# EAGLE schematic XMICRO-SERIAL V1.0 (EAGLE 6.3)
PROJECT_NAME: XMICRO-SERIAL; PROJECT_REVISION: 1.0

## Sheet 1 of 6: UARTs
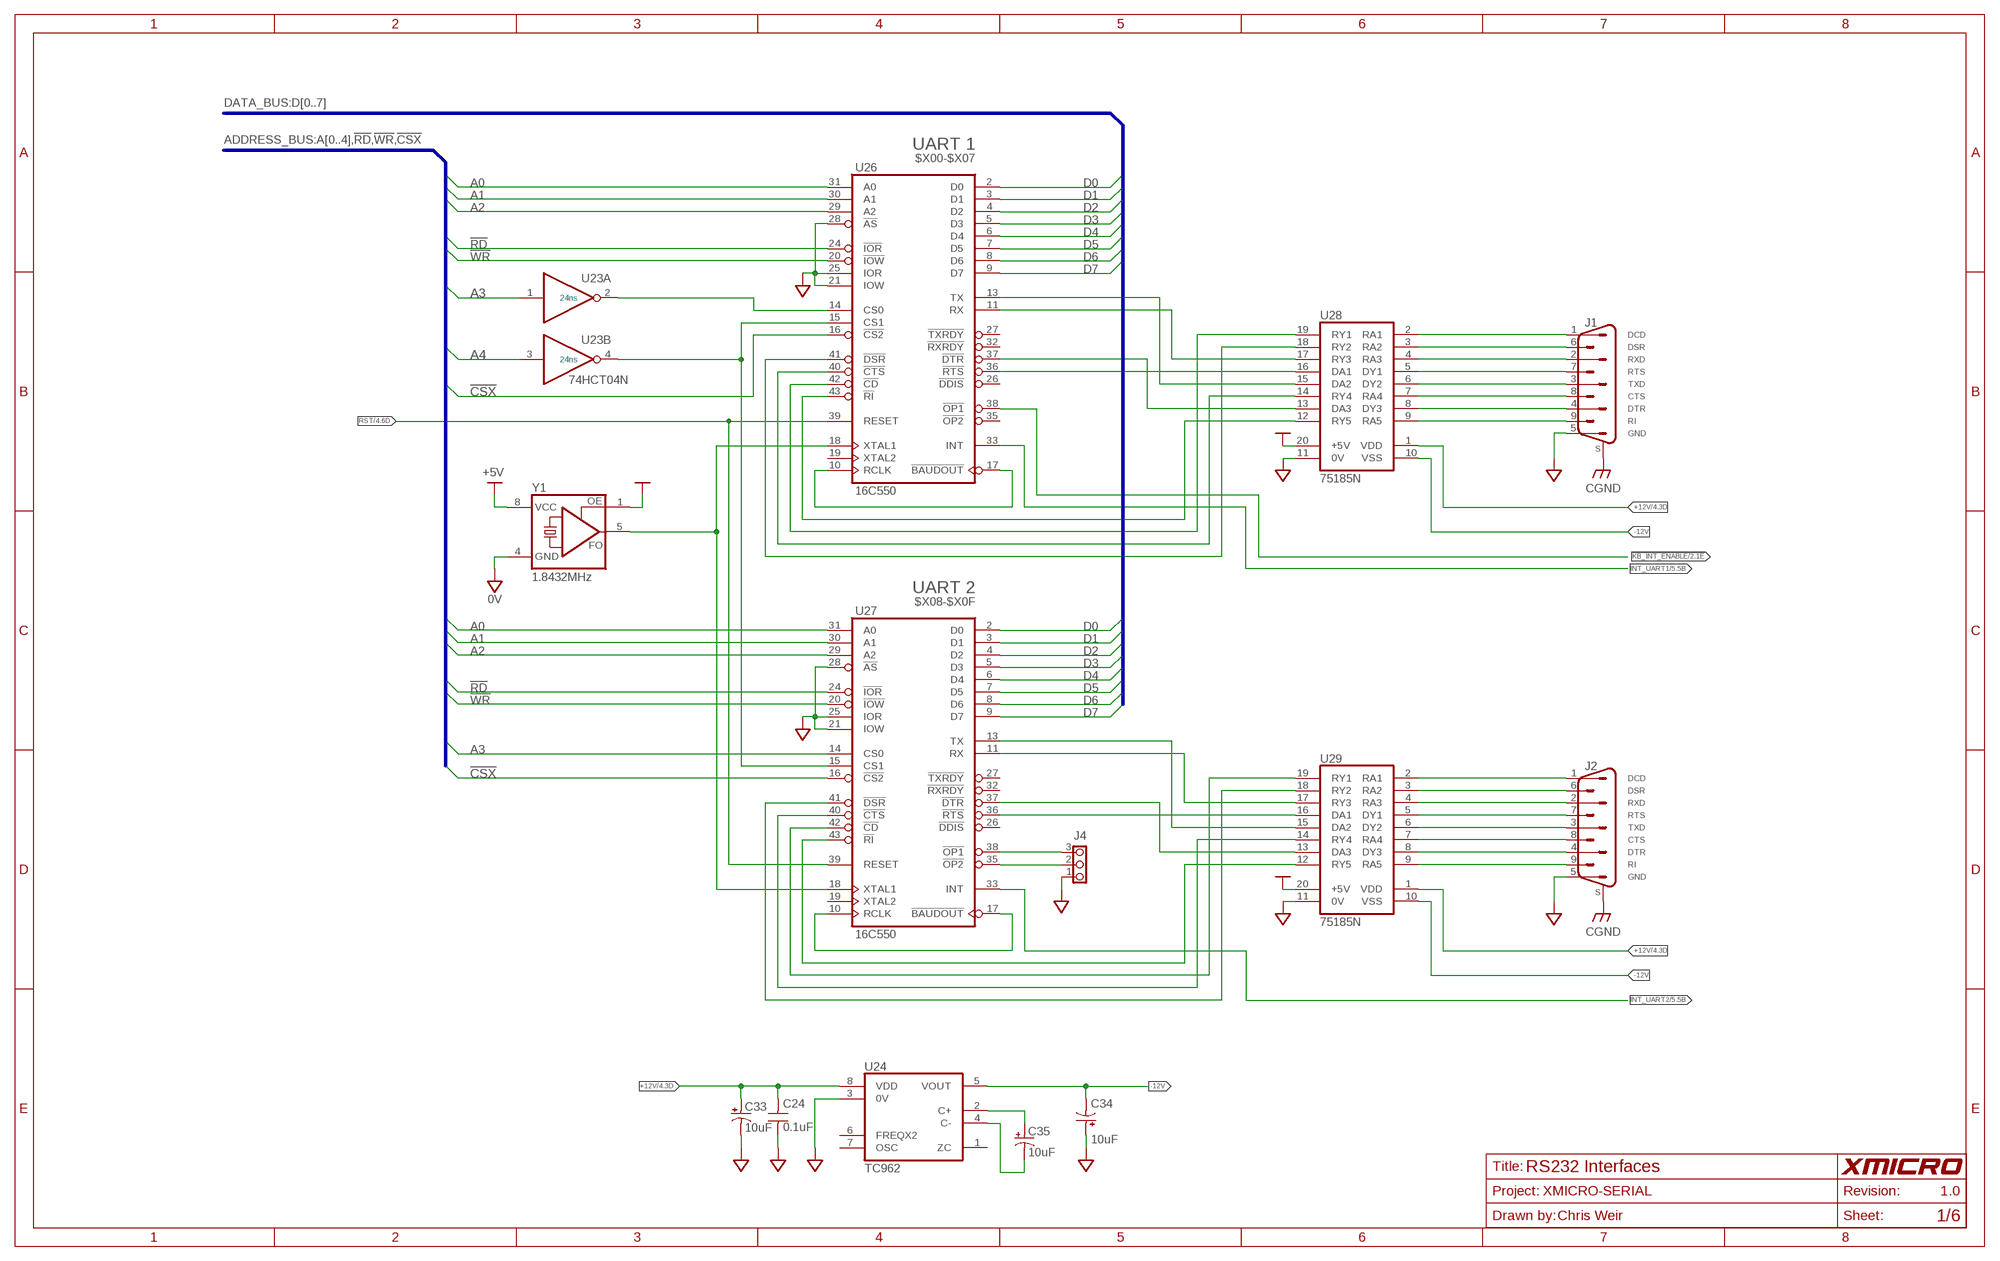
[diagram p0: schematic, sheet 1]
FRAME1 (11X17): DRAWN_BY: Chris Weir; SHEET_TITLE: RS232 Interfaces

### Parts
C24  0.1uF  C-US025-024X044  [C025-024X044]
C33  10uF  CPOL-USE2.5-5  [E2,5-5]
C34  10uF  CPOL-USE2.5-5  [E2,5-5]
C35  10uF  CPOL-USE2.5-5  [E2,5-5]
J1  DSUB-9M-PH  [DSUB-9M-H]
J2  DSUB-9M-PH  [DSUB-9M-H]
J4  1X3  [1X3]
U23  74HCT04N  [DIL14]
U24  TC962  [DIL8]
U26  16C550  16C550S44  [S44]
U27  16C550  16C550S44  [S44]
U28  75185N  75C185N  [DIL20]
U29  75185N  75C185N  [DIL20]
Y1  1.8432MHz  OSC-OE  [DIL08S]

### Nets
0V [0V]: C24.2 C33.- C34.+ J1.5 J2.5 J4.1 U24.3(0V) U26.21(IOW) U26.25(IOR) U26.28(!AS) U27.21(IOW) U27.25(IOR) U27.28(!AS) U28.11(0V) U29.11(0V) Y1.4(0V) ; also sheet 2,3,4,5,6
!CSX: U26.16(!CS2) U27.16(!CS2) ; also sheet 4,5
!KB_INT_ENABLE: U26.38(!OP1) ; also sheet 2
!RD: U26.24(!IOR) U27.24(!IOR) ; also sheet 4,5
!WR: U26.20(!IOW) U27.20(!IOW) ; also sheet 4,5
+5V [SUPPLY]: U28.20(+5V) U29.20(+5V) Y1.1(OE) Y1.8(+5V) ; also sheet 2,3,4,5,6
+12V [SUPPLY]: C24.1 C33.+ U24.8(VDD) U28.1(VDD) U29.1(VDD) ; also sheet 4
-12V [SUPPLY]: C34.- U24.5(VOUT) U28.10(VSS) U29.10(VSS)
A0: U26.31(A0) U27.31(A0) ; also sheet 4,5
A1: U26.30(A1) U27.30(A1) ; also sheet 4,5
A2: U26.29(A2) U27.29(A2) ; also sheet 4,5
A3: U23.1(A:I) U27.14(CS0) ; also sheet 4
A4: U23.3(B:I) ; also sheet 4,5
CGND [CHASSIS]: J1.S1(S) J1.S2(S) J2.S1(S) J2.S2(S) ; also sheet 2,6
D0: U26.2(D0) U27.2(D0) ; also sheet 2,3,4,5
D1: U26.3(D1) U27.3(D1) ; also sheet 2,3,4,5
D2: U26.4(D2) U27.4(D2) ; also sheet 2,3,4,5
D3: U26.5(D3) U27.5(D3) ; also sheet 2,3,4,5
D4: U26.6(D4) U27.6(D4) ; also sheet 2,3,4,5
D5: U26.7(D5) U27.7(D5) ; also sheet 2,3,4,5
D6: U26.8(D6) U27.8(D6) ; also sheet 2,3,4,5
D7: U26.9(D7) U27.9(D7) ; also sheet 2,3,4,5
INT_UART1: U26.33(INT) ; also sheet 5,6
INT_UART2: U27.33(INT) ; also sheet 5,6
N$1: J1.1 U28.2(RA1)
N$2: J1.2 U28.4(RA3)
N$3: J1.3 U28.6(DY2)
N$4: J1.4 U28.8(DY3)
N$5: J1.6 U28.3(RA2)
N$6: J1.7 U28.5(DY1)
N$7: J1.8 U28.7(RA4)
N$8: J1.9 U28.9(RA5)
N$9: J2.1 U29.2(RA1)
N$10: U26.43(!RI) U28.12(RY5)
N$11: U26.37(!DTR) U28.13(DA3)
N$12: U26.40(!CTS) U28.14(RY4)
N$13: U26.13(TX) U28.15(DA2)
N$14: U26.36(!RTS) U28.16(DA1)
N$15: U26.11(RX) U28.17(RY3)
N$16: U26.41(!DSR) U28.18(RY2)
N$17: U26.42(!CD) U28.19(RY1)
N$18: U26.10(RCLK) U26.17(!BAUDOUT)
N$27: C35.- U24.4(C-)
N$28: J2.2 U29.4(RA3)
N$29: J2.3 U29.6(DY2)
N$30: J2.4 U29.8(DY3)
N$31: J2.6 U29.3(RA2)
N$32: J2.7 U29.5(DY1)
N$41: J2.8 U29.7(RA4)
N$42: J2.9 U29.9(RA5)
N$43: C35.+ U24.2(C+)
N$46: U23.2(A:O) U26.14(CS0)
N$47: U27.43(!RI) U29.12(RY5)
N$48: U27.37(!DTR) U29.13(DA3)
N$49: U27.40(!CTS) U29.14(RY4)
N$51: J4.3 U27.38(!OP1)
N$52: J4.2 U27.35(!OP2)
N$60: U27.13(TX) U29.15(DA2)
N$61: U27.36(!RTS) U29.16(DA1)
N$62: U27.11(RX) U29.17(RY3)
N$63: U27.41(!DSR) U29.18(RY2)
N$64: U27.42(!CD) U29.19(RY1)
N$65: U27.10(RCLK) U27.17(!BAUDOUT)
N$114: U23.4(B:O) U26.15(CS1) U27.15(CS1)
N$116: U26.18(XTAL1) U27.18(XTAL1) Y1.5(FO)
RST: U26.39(RESET) U27.39(RESET) ; also sheet 4
Unconnected: U24.1(ZC) U24.6(FREQX2) U24.7(OSC) U26.19(XTAL2) U26.26(!DDIS) U26.27(!TXRDY) U26.32(!RXRDY) U26.35(!OP2) U27.19(XTAL2) U27.26(!DDIS) U27.27(!TXRDY) U27.32(!RXRDY)

### Buses
DATA_BUS:D[0..7]
ADDRESS_BUS:A[0..4],!RD,!WR,!CSX

### Notes on the sheet
- UART 1
- $X00-$X07
- DCD
- DSR
- RXD
- RTS
- TXD
- CTS
- DTR
- RI
- GND
- UART 2
- $X08-$X0F
- DCD
- DSR
- RXD
- RTS
- TXD
- CTS
- DTR
- RI
- GND

## Sheet 2 of 6: PS/2 Receive
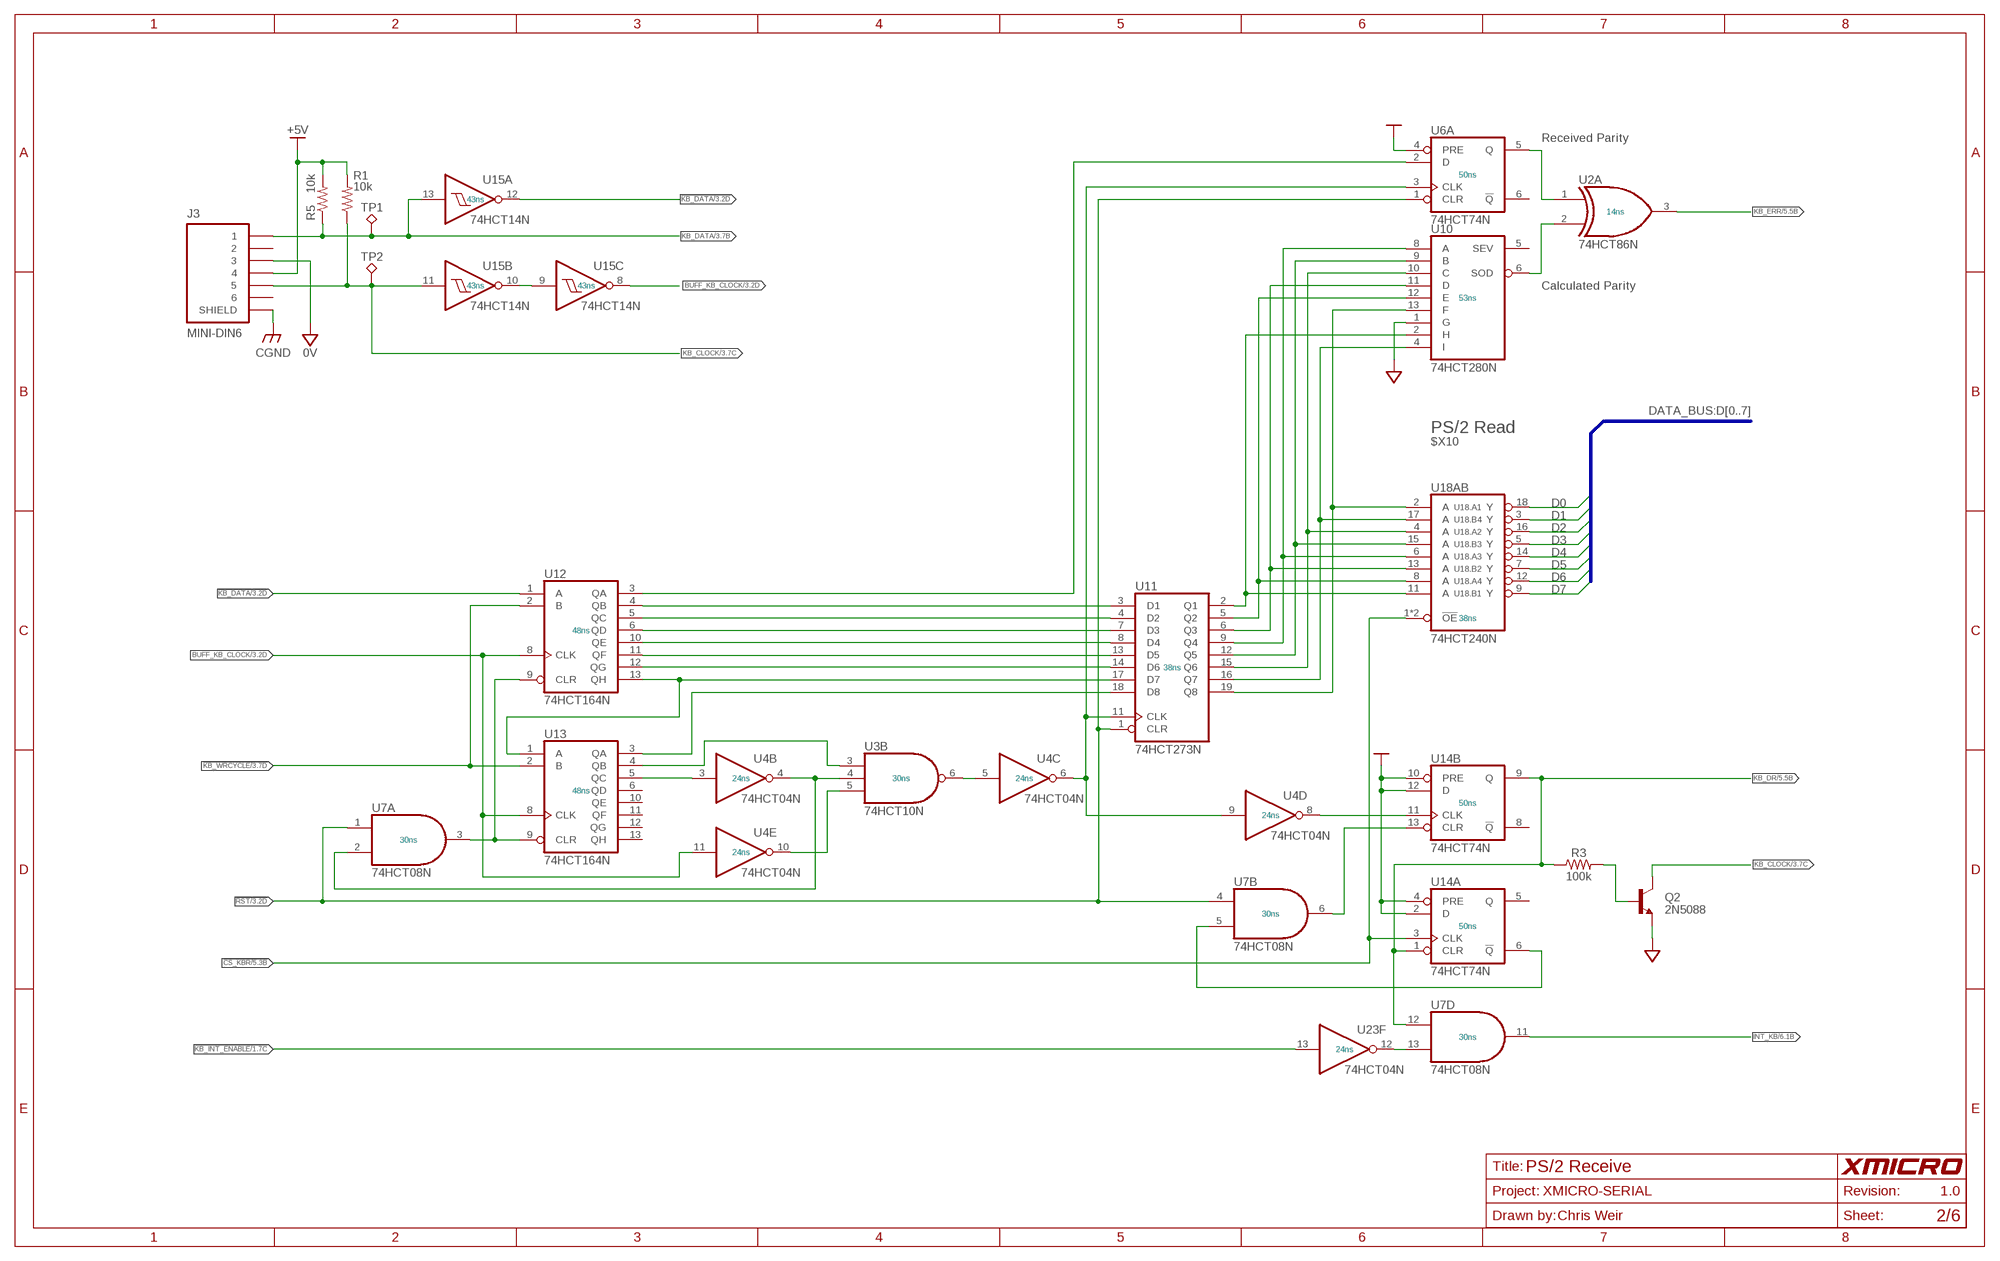
[diagram p1: schematic, sheet 2]
FRAME2 (11X17): DRAWN_BY: Chris Weir; SHEET_TITLE: PS/2 Receive

### Parts
J3  MINI-DIN6  [MINI-DIN6]
Q2  2N5088  [TO92]
R1  10k  R-US_0207/10  [0207/10]
R3  100k  R-US_0207/10  [0207/10]
R5  10k  R-US_0207/10  [0207/10]
TP1  TP-040  [TP-040]
TP2  TP-040  [TP-040]
U2  74HCT86N  [DIL14]
U3  74HCT10N  [DIL14]
U4  74HCT04N  [DIL14]
U6  74HCT74N  [DIL14]
U7  74HCT08N  [DIL14]
U10  74HCT280N  [DIL14]
U11  74HCT273N  [DIL20]
U12  74HCT164N  [DIL14]
U13  74HCT164N  [DIL14]
U14  74HCT74N  [DIL14]
U15  74HCT14N  [DIL14]
U18  74HCT240N  74HCT240-1SN  [DIL20]

### Nets
0V [0V]: J3.3 Q2.1(E) U10.1(G) ; also sheet 1,3,4,5,6
!CS_KBR: U14.3(A:CLK) U18.1(AB:!OE) U18.19(AB:!OE) ; also sheet 5
!KB_DATA: U12.1(A) U15.12(A:O) ; also sheet 3
!KB_INT_ENABLE: U23.13(F:I) ; also sheet 1
!KB_WRCYCLE: U12.2(B) U13.2(B) ; also sheet 3
!RST: U6.1(A:CLR) U7.1(A:I0) U7.4(B:I0) U11.1(CLR) ; also sheet 3,4
+5V [SUPPLY]: J3.4 R1.2 R5.2 U6.4(A:PRE) U14.2(A:D) U14.4(A:PRE) U14.10(B:PRE) U14.12(B:D) ; also sheet 1,3,4,5,6
BUFF_KB_CLOCK: U4.11(E:I) U12.8(CLK) U13.8(CLK) U15.8(C:O) ; also sheet 3
CGND [CHASSIS]: J3.G$1(SHIELD) J3.G$2(SHIELD) J3.G$3(SHIELD) ; also sheet 1,6
D0: U18.18(.A1:Y) ; also sheet 1,3,4,5
D1: U18.3(.B4:Y) ; also sheet 1,3,4,5
D2: U18.16(.A2:Y) ; also sheet 1,3,4,5
D3: U18.5(.B3:Y) ; also sheet 1,3,4,5
D4: U18.14(.A3:Y) ; also sheet 1,3,4,5
D5: U18.7(.B2:Y) ; also sheet 1,3,4,5
D6: U18.12(.A4:Y) ; also sheet 1,3,4,5
D7: U18.9(.B1:Y) ; also sheet 1,3,4,5
INT_KB: U7.11(D:O) ; also sheet 6
KB_CLOCK: J3.5 Q2.3(C) R1.1 TP2.1 U15.11(B:I) ; also sheet 3
KB_DATA: J3.1 R5.1 TP1.1 U15.13(A:I) ; also sheet 3
KB_DR: R3.1 U7.12(D:I0) U14.1(A:CLR) U14.9(B:Q) ; also sheet 5
KB_ERR: U2.3(A:O) ; also sheet 5
N$19: U3.6(B:O) U4.5(C:I)
N$20: U4.8(D:O) U14.11(B:CLK)
N$26: U15.9(C:I) U15.10(B:O)
N$50: U7.13(D:I1) U23.12(F:O)
N$66: U11.17(D7) U12.13(QH) U13.1(A)
N$67: U11.18(D8) U13.3(QA)
N$69: U4.3(B:I) U13.5(QC)
N$70: U3.4(B:I1) U4.4(B:O) U7.2(A:I1)
N$71: U4.6(C:O) U4.9(D:I) U6.3(A:CLK) U11.11(CLK)
N$72: U3.3(B:I0) U13.4(QB)
N$73: U11.14(D6) U12.12(QG)
N$74: U11.13(D5) U12.11(QF)
N$76: U11.7(D3) U12.6(QD)
N$77: U11.4(D2) U12.5(QC)
N$78: U11.3(D1) U12.4(QB)
N$79: U6.2(A:D) U12.3(QA)
N$81: U7.3(A:O) U12.9(CLR) U13.9(CLR)
N$82: U7.6(B:O) U14.13(B:CLR)
N$84: U2.1(A:I0) U6.5(A:Q)
N$86: U10.13(F) U11.19(Q8) U18.2(.A1:A)
N$90: U10.4(I) U11.16(Q7) U18.17(.B4:A)
N$91: U10.10(C) U11.15(Q6) U18.4(.A2:A)
N$92: U10.9(B) U11.12(Q5) U18.15(.B3:A)
N$94: U10.11(D) U11.6(Q3) U18.13(.B2:A)
N$95: U10.12(E) U11.5(Q2) U18.8(.A4:A)
N$96: U10.2(H) U11.2(Q1) U18.11(.B1:A)
N$97: U10.8(A) U11.9(Q4) U18.6(.A3:A)
N$101: U2.2(A:I1) U10.6(SOD)
N$102: U3.5(B:I2) U4.10(E:O)
N$105: Q2.2(B) R3.2
N$108: U7.5(B:I1) U14.6(A:!Q)
UC4: U11.8(D4) U12.10(QE)
Unconnected: J3.2 J3.6 U6.6(A:!Q) U10.5(SEV) U13.6(QD) U13.10(QE) U13.11(QF) U13.12(QG) U13.13(QH) U14.5(A:Q) U14.8(B:!Q)

### Buses
DATA_BUS:D[0..7]

### Notes on the sheet
- Received Parity
- Calculated Parity
- PS/2 Read
- $X10

## Sheet 3 of 6: PS/2 Transmit
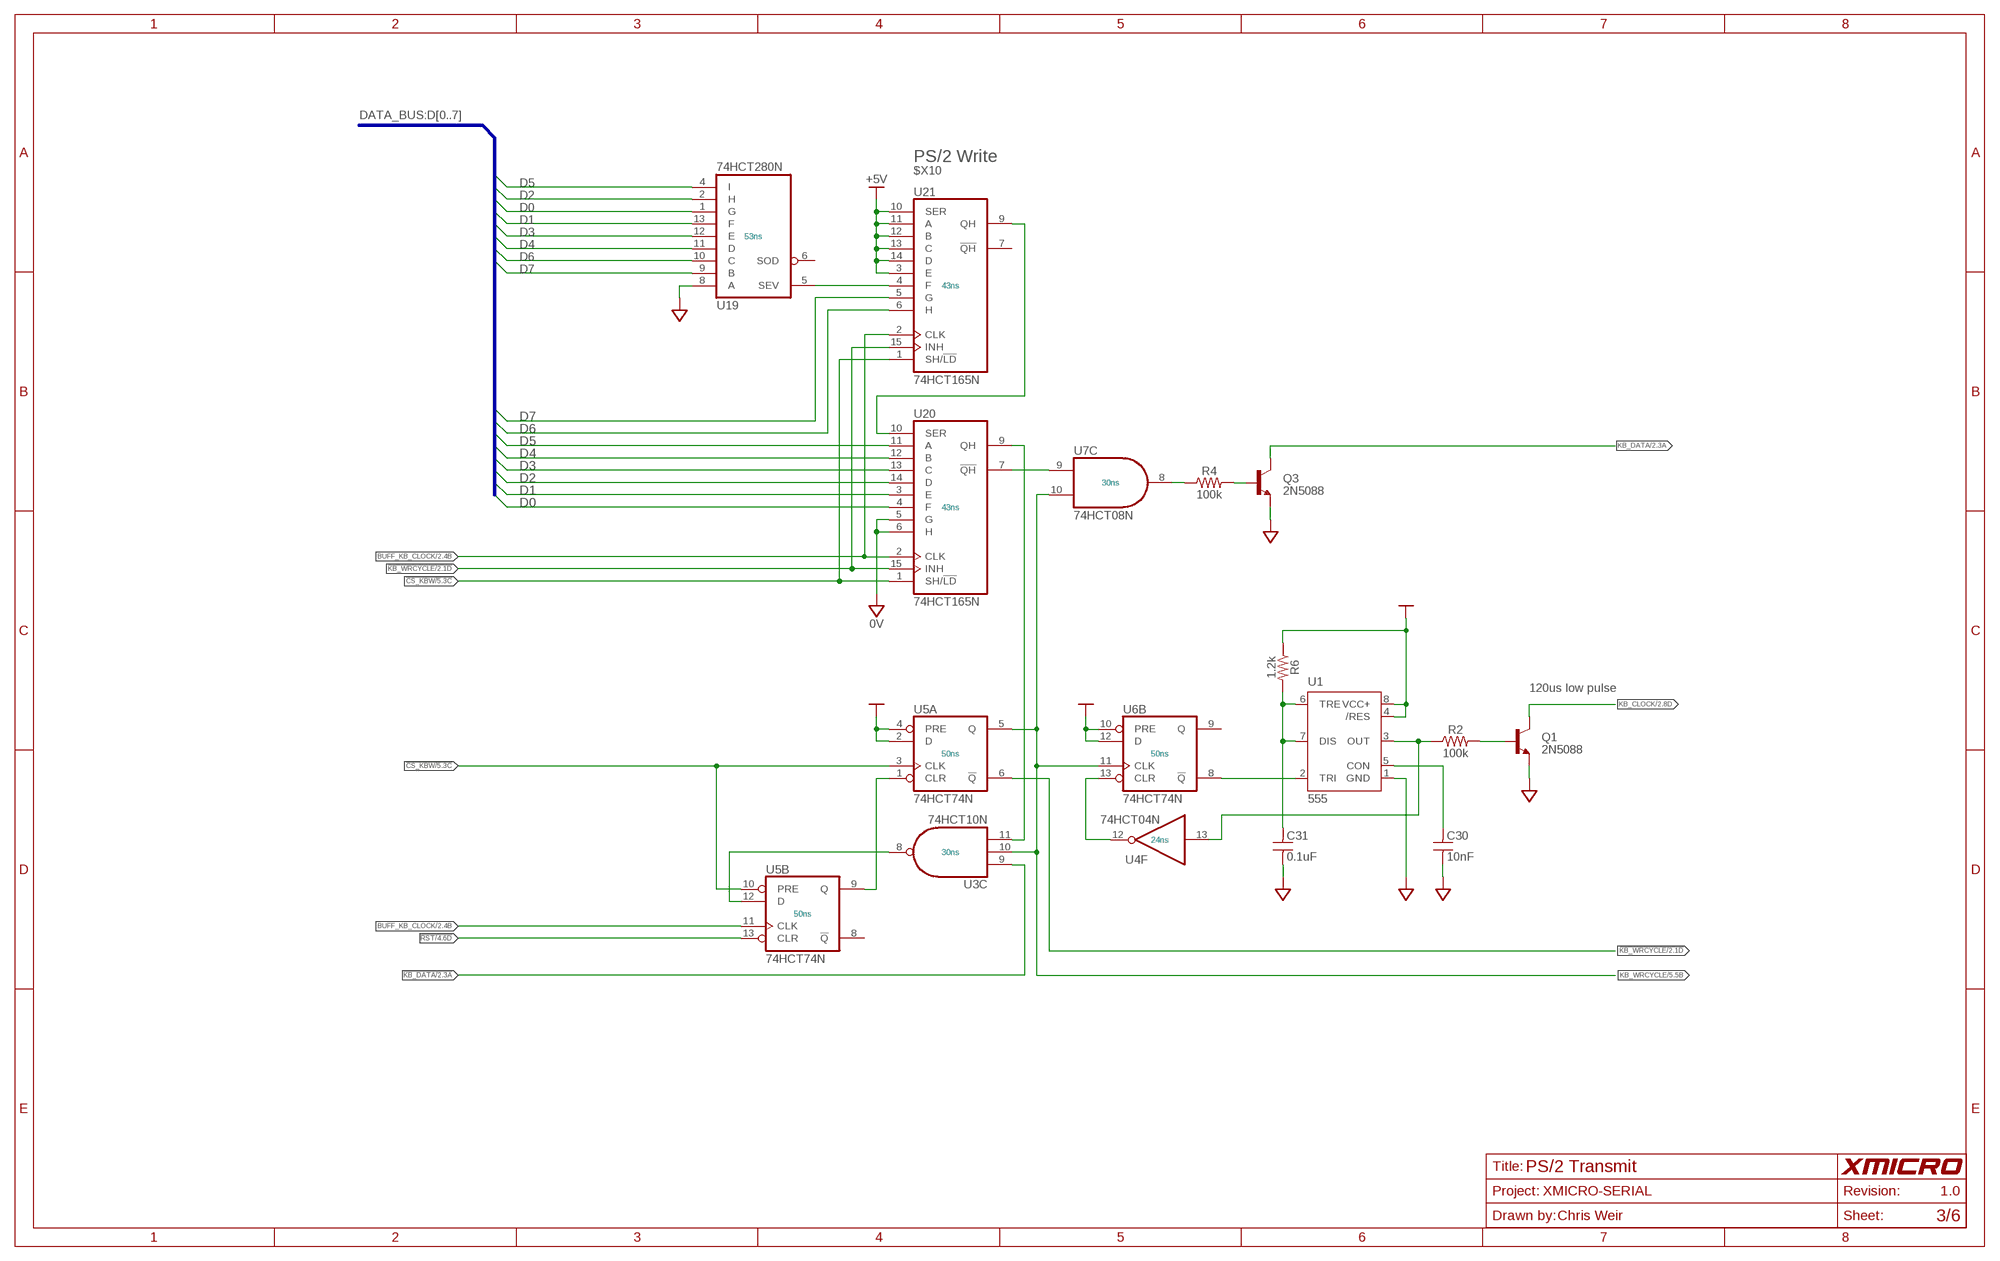
[diagram p2: schematic, sheet 3]
FRAME3 (11X17): DRAWN_BY: Chris Weir; SHEET_TITLE: PS/2 Transmit

### Parts
C30  10nF  C-US025-024X044  [C025-024X044]
C31  0.1uF  C-US025-024X044  [C025-024X044]
Q1  2N5088  [TO92]
Q3  2N5088  [TO92]
R2  100k  R-US_0207/10  [0207/10]
R4  100k  R-US_0207/10  [0207/10]
R6  1.2k  R-US_0207/10  [0207/10]
U1  555  NE555  [DIL-08]
U5  74HCT74N  [DIL14]
U19  74HCT280N  [DIL14]
U20  74HCT165N  [DIL16]
U21  74HCT165N  [DIL16]

### Nets
0V [0V]: C30.2 C31.2 Q1.1(E) Q3.1(E) U1.1(GND) U19.8(A) U20.5(G) U20.6(H) ; also sheet 1,2,4,5,6
!CS_KBW: U5.3(A:CLK) U5.10(B:PRE) U20.1(SH/!LD) U21.1(SH/!LD) ; also sheet 5
!KB_DATA: U3.9(C:I0) ; also sheet 2
!KB_WRCYCLE: U5.6(A:!Q) U20.15(INH) U21.15(INH) ; also sheet 2
!RST: U5.13(B:CLR) ; also sheet 2,4
+5V [SUPPLY]: R6.1 U1.4(/RES) U1.8(VCC+) U5.2(A:D) U5.4(A:PRE) U6.10(B:PRE) U6.12(B:D) U21.3(E) U21.10(SER) U21.11(A) U21.12(B) U21.13(C) U21.14(D) ; also sheet 1,2,4,5,6
BUFF_KB_CLOCK: U5.11(B:CLK) U20.2(CLK) U21.2(CLK) ; also sheet 2
D0: U19.1(G) U20.4(F) ; also sheet 1,2,4,5
D1: U19.13(F) U20.3(E) ; also sheet 1,2,4,5
D2: U19.2(H) U20.14(D) ; also sheet 1,2,4,5
D3: U19.12(E) U20.13(C) ; also sheet 1,2,4,5
D4: U19.11(D) U20.12(B) ; also sheet 1,2,4,5
D5: U19.4(I) U20.11(A) ; also sheet 1,2,4,5
D6: U19.10(C) U21.6(H) ; also sheet 1,2,4,5
D7: U19.9(B) U21.5(G) ; also sheet 1,2,4,5
KB_CLOCK: Q1.3(C) ; also sheet 2
KB_DATA: Q3.3(C) ; also sheet 2
KB_WRCYCLE: U3.10(C:I1) U5.5(A:Q) U6.11(B:CLK) U7.10(C:I1) ; also sheet 5
N$22: U3.8(C:O) U5.12(B:D)
N$23: U4.12(F:O) U6.13(B:CLR)
N$87: U3.11(C:I2) U20.9(QH)
N$99: U7.9(C:I0) U20.7(!QH)
N$103: R4.1 U7.8(C:O)
N$111: U20.10(SER) U21.9(QH)
N$120: U19.5(SEV) U21.4(F)
N$124: Q3.2(B) R4.2
N$126: Q1.2(B) R2.2
N$131: U5.1(A:CLR) U5.9(B:Q)
N$132: U1.2(TRI) U6.8(B:!Q)
N$133: C31.1 R6.2 U1.6(TRE) U1.7(DIS)
N$137: R2.1 U1.3(OUT) U4.13(F:I)
N$140: C30.1 U1.5(CON)
Unconnected: U5.8(B:!Q) U6.9(B:Q) U19.6(SOD) U21.7(!QH)

### Buses
DATA_BUS:D[0..7]

### Notes on the sheet
- PS/2 Write
- $X10
- 120us low pulse

## Sheet 4 of 6: Bus Interface
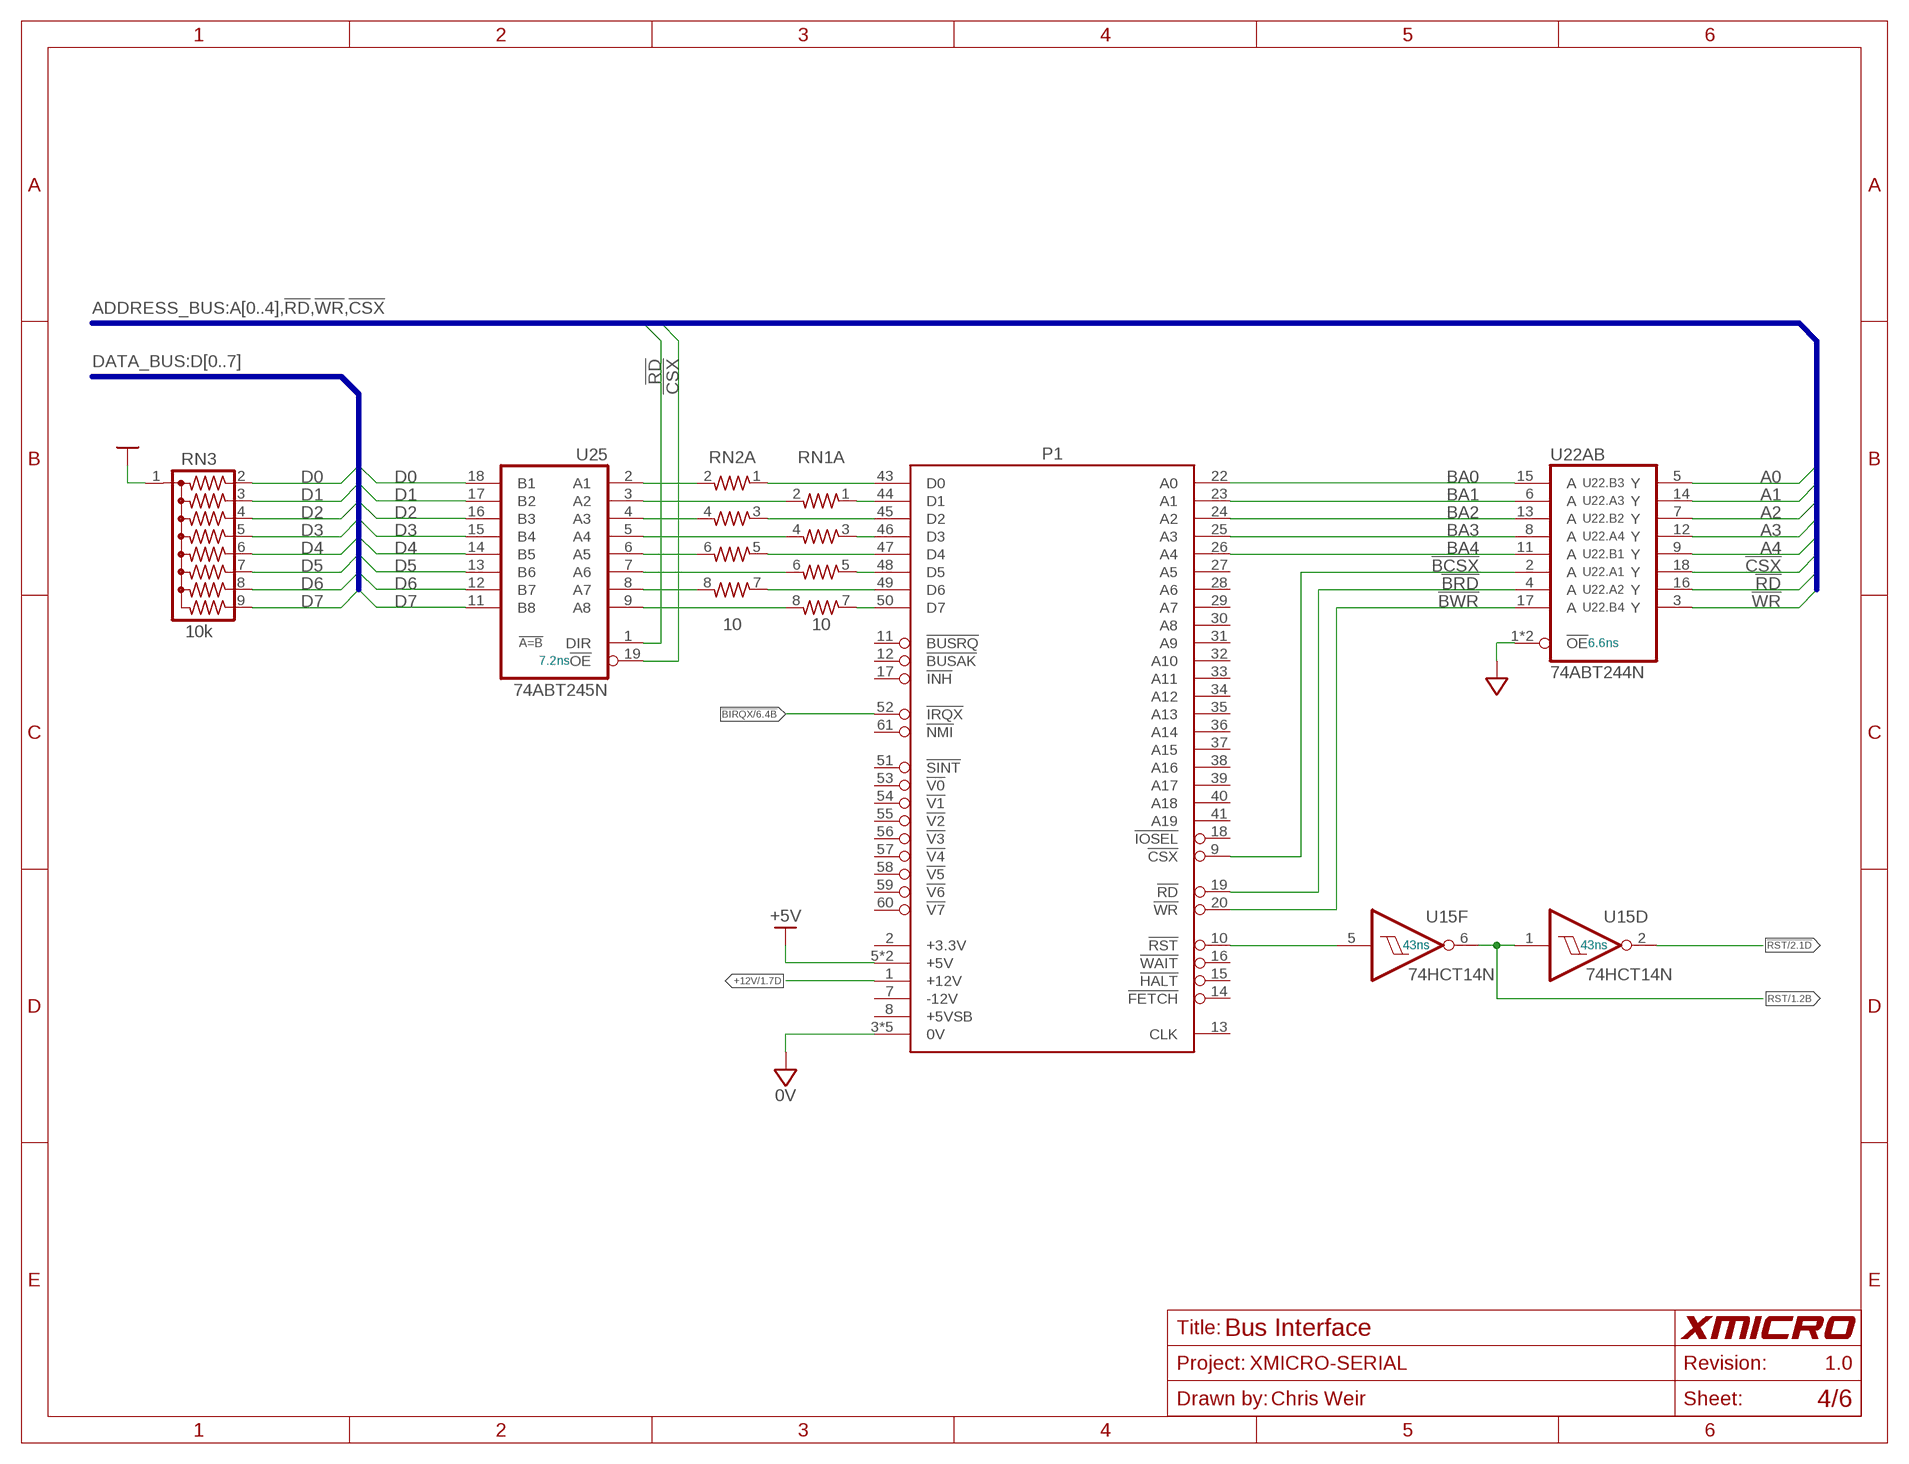
[diagram p3: schematic, sheet 4]
FRAME4 (LETTER): DRAWN_BY: Chris Weir; SHEET_TITLE: Bus Interface

### Parts
P1  XMICRO-BUS-EDGE  [EDGE62M]
RN1  10  E4R  [SIL8]
RN2  10  E4R  [SIL8]
RN3  10k  G08R  [SIL9]
U22  74ABT244N  74ABT244-1SN  [DIL20]
U25  74ABT245N  [DIL20]

### Nets
0V [0V]: P1.3(0V) P1.4(0V) P1.21(0V) P1.42(0V) P1.62(0V) U22.1(AB:!OE) U22.19(AB:!OE) ; also sheet 1,2,3,5,6
!BCSX: P1.9(!CSX) U22.2(.A1:A)
!BIRQX: P1.52(!IRQX) ; also sheet 6
!BRD: P1.19(!RD) U22.4(.A2:A)
!BRST: P1.10(!RST) U15.5(F:I)
!BWR: P1.20(!WR) U22.17(.B4:A)
!CSX: U22.18(.A1:Y) U25.19(!OE) ; also sheet 1,5
!RD: U22.16(.A2:Y) U25.1(DIR) ; also sheet 1,5
!RST: U15.2(D:O) ; also sheet 2,3
!WR: U22.3(.B4:Y) ; also sheet 1,5
+5V [SUPPLY]: P1.5(+5V) P1.6(+5V) RN3.1 ; also sheet 1,2,3,5,6
+12V [SUPPLY]: P1.1(+12V) ; also sheet 1
A0: U22.5(.B3:Y) ; also sheet 1,5
A1: U22.14(.A3:Y) ; also sheet 1,5
A2: U22.7(.B2:Y) ; also sheet 1,5
A3: U22.12(.A4:Y) ; also sheet 1
A4: U22.9(.B1:Y) ; also sheet 1,5
BA0: P1.22(A0) U22.15(.B3:A)
BA1: P1.23(A1) U22.6(.A3:A)
BA2: P1.24(A2) U22.13(.B2:A)
BA3: P1.25(A3) U22.8(.A4:A)
BA4: P1.26(A4) U22.11(.B1:A)
D0: RN3.2 U25.18(B1) ; also sheet 1,2,3,5
D1: RN3.3 U25.17(B2) ; also sheet 1,2,3,5
D2: RN3.4 U25.16(B3) ; also sheet 1,2,3,5
D3: RN3.5 U25.15(B4) ; also sheet 1,2,3,5
D4: RN3.6 U25.14(B5) ; also sheet 1,2,3,5
D5: RN3.7 U25.13(B6) ; also sheet 1,2,3,5
D6: RN3.8 U25.12(B7) ; also sheet 1,2,3,5
D7: RN3.9 U25.11(B8) ; also sheet 1,2,3,5
N$33: RN1.8 U25.9(A8)
N$34: P1.49(D6) RN2.7
N$35: RN1.6 U25.7(A6)
N$36: P1.47(D4) RN2.5
N$37: RN1.4 U25.5(A4)
N$38: P1.45(D2) RN2.3
N$39: RN1.2 U25.3(A2)
N$40: P1.43(D0) RN2.1
N$53: RN2.2 U25.2(A1)
N$54: RN2.4 U25.4(A3)
N$55: RN2.6 U25.6(A5)
N$56: RN2.8 U25.8(A7)
N$57: P1.50(D7) RN1.7
N$58: P1.48(D5) RN1.5
N$59: P1.46(D3) RN1.3
N$68: P1.44(D1) RN1.1
RST: U15.1(D:I) U15.6(F:O) ; also sheet 1
Unconnected: P1.2(+3.3V) P1.7(-12V) P1.8(+5VSB) P1.11(!BUSRQ) P1.12(!BUSAK) P1.13(CLK) P1.14(!FETCH) P1.15(!HALT) P1.16(!WAIT) P1.17(!INH) P1.18(!IOSEL) P1.27(A5) P1.28(A6) P1.29(A7) P1.30(A8) P1.31(A9) P1.32(A10) P1.33(A11) P1.34(A12) P1.35(A13) P1.36(A14) P1.37(A15) P1.38(A16) P1.39(A17) P1.40(A18) P1.41(A19) P1.51(!SINT) P1.53(!V0) P1.54(!V1) P1.55(!V2) P1.56(!V3) P1.57(!V4) P1.58(!V5) P1.59(!V6) P1.60(!V7) P1.61(!NMI)

### Buses
DATA_BUS:D[0..7]
ADDRESS_BUS:A[0..4],!RD,!WR,!CSX

## Sheet 5 of 6: Chip Selects/Registers
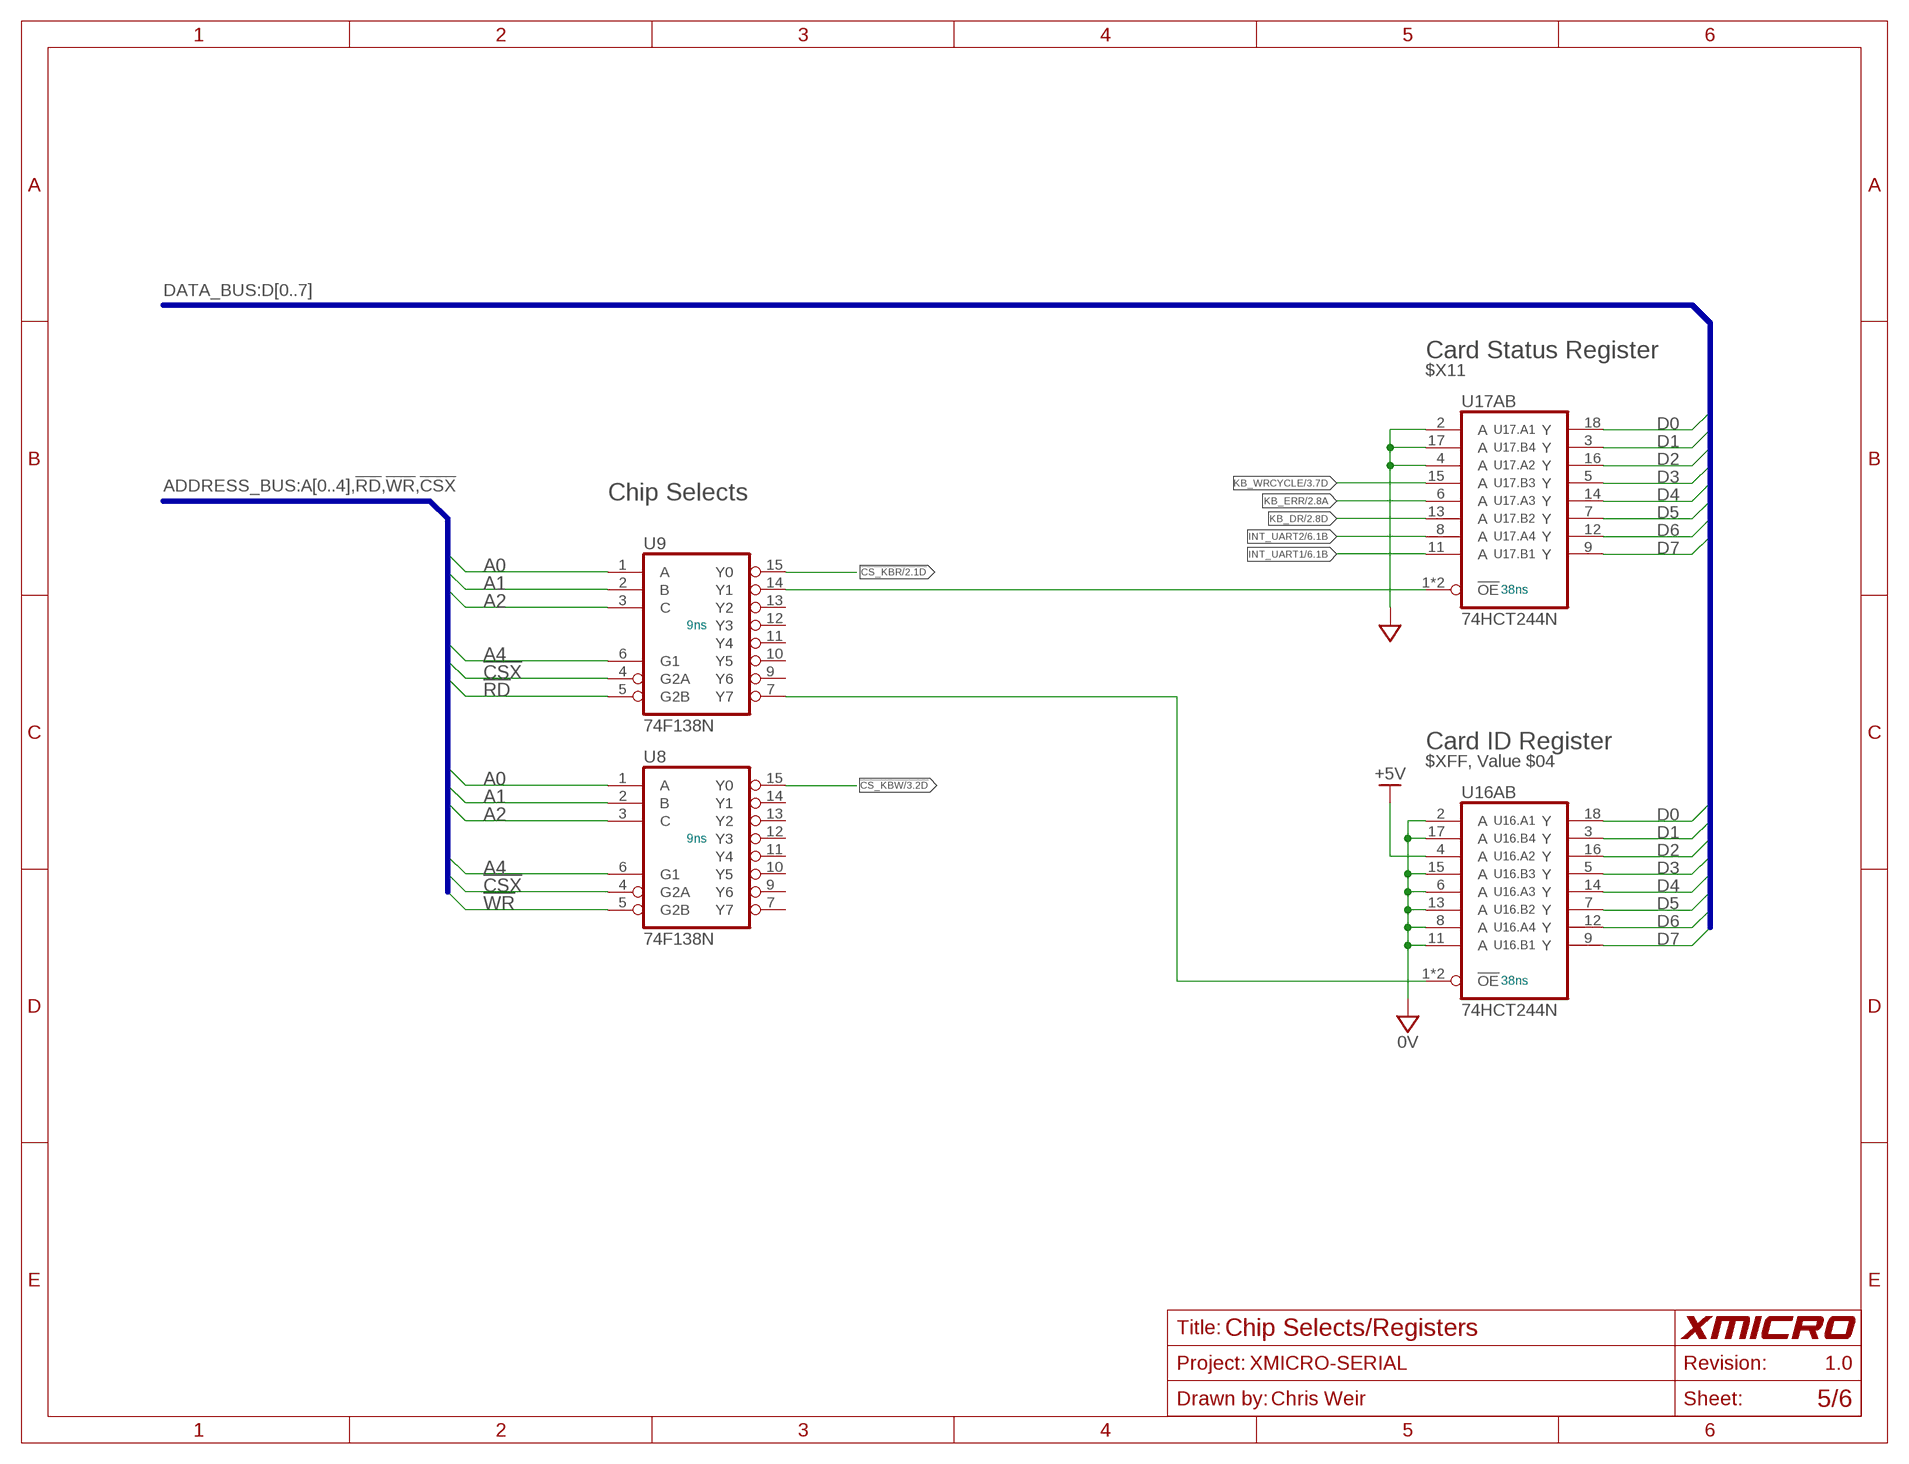
[diagram p4: schematic, sheet 5]
FRAME5 (LETTER): DRAWN_BY: Chris Weir; SHEET_TITLE: Chip Selects/Registers

### Parts
U8  74F138N  [DIL16]
U9  74F138N  [DIL16]
U16  74HCT244N  74HCT244-1SN  [DIL20]
U17  74HCT244N  74HCT244-1SN  [DIL20]

### Nets
0V [0V]: U16.2(.A1:A) U16.6(.A3:A) U16.8(.A4:A) U16.11(.B1:A) U16.13(.B2:A) U16.15(.B3:A) U16.17(.B4:A) U17.2(.A1:A) U17.4(.A2:A) U17.17(.B4:A) ; also sheet 1,2,3,4,6
!CS_IDR: U9.7(Y7) U16.1(AB:!OE) U16.19(AB:!OE)
!CS_KBR: U9.15(Y0) ; also sheet 2
!CS_KBW: U8.15(Y0) ; also sheet 3
!CS_STR: U9.14(Y1) U17.1(AB:!OE) U17.19(AB:!OE)
!CSX: U8.4(G2A) U9.4(G2A) ; also sheet 1,4
!RD: U9.5(G2B) ; also sheet 1,4
!WR: U8.5(G2B) ; also sheet 1,4
+5V [SUPPLY]: U16.4(.A2:A) ; also sheet 1,2,3,4,6
A0: U8.1(A) U9.1(A) ; also sheet 1,4
A1: U8.2(B) U9.2(B) ; also sheet 1,4
A2: U8.3(C) U9.3(C) ; also sheet 1,4
A4: U8.6(G1) U9.6(G1) ; also sheet 1,4
D0: U16.18(.A1:Y) U17.18(.A1:Y) ; also sheet 1,2,3,4
D1: U16.3(.B4:Y) U17.3(.B4:Y) ; also sheet 1,2,3,4
D2: U16.16(.A2:Y) U17.16(.A2:Y) ; also sheet 1,2,3,4
D3: U16.5(.B3:Y) U17.5(.B3:Y) ; also sheet 1,2,3,4
D4: U16.14(.A3:Y) U17.14(.A3:Y) ; also sheet 1,2,3,4
D5: U16.7(.B2:Y) U17.7(.B2:Y) ; also sheet 1,2,3,4
D6: U16.12(.A4:Y) U17.12(.A4:Y) ; also sheet 1,2,3,4
D7: U16.9(.B1:Y) U17.9(.B1:Y) ; also sheet 1,2,3,4
INT_UART1: U17.11(.B1:A) ; also sheet 1,6
INT_UART2: U17.8(.A4:A) ; also sheet 1,6
KB_DR: U17.13(.B2:A) ; also sheet 2
KB_ERR: U17.6(.A3:A) ; also sheet 2
KB_WRCYCLE: U17.15(.B3:A) ; also sheet 3
Unconnected: U8.7(Y7) U8.9(Y6) U8.10(Y5) U8.11(Y4) U8.12(Y3) U8.13(Y2) U8.14(Y1) U9.9(Y6) U9.10(Y5) U9.11(Y4) U9.12(Y3) U9.13(Y2)

### Buses
DATA_BUS:D[0..7]
ADDRESS_BUS:A[0..4],!RD,!WR,!CSX

### Notes on the sheet
- Card Status Register
- $X11
- Chip Selects
- Card ID Register
- $XFF, Value $04

## Sheet 6 of 6: Misc.
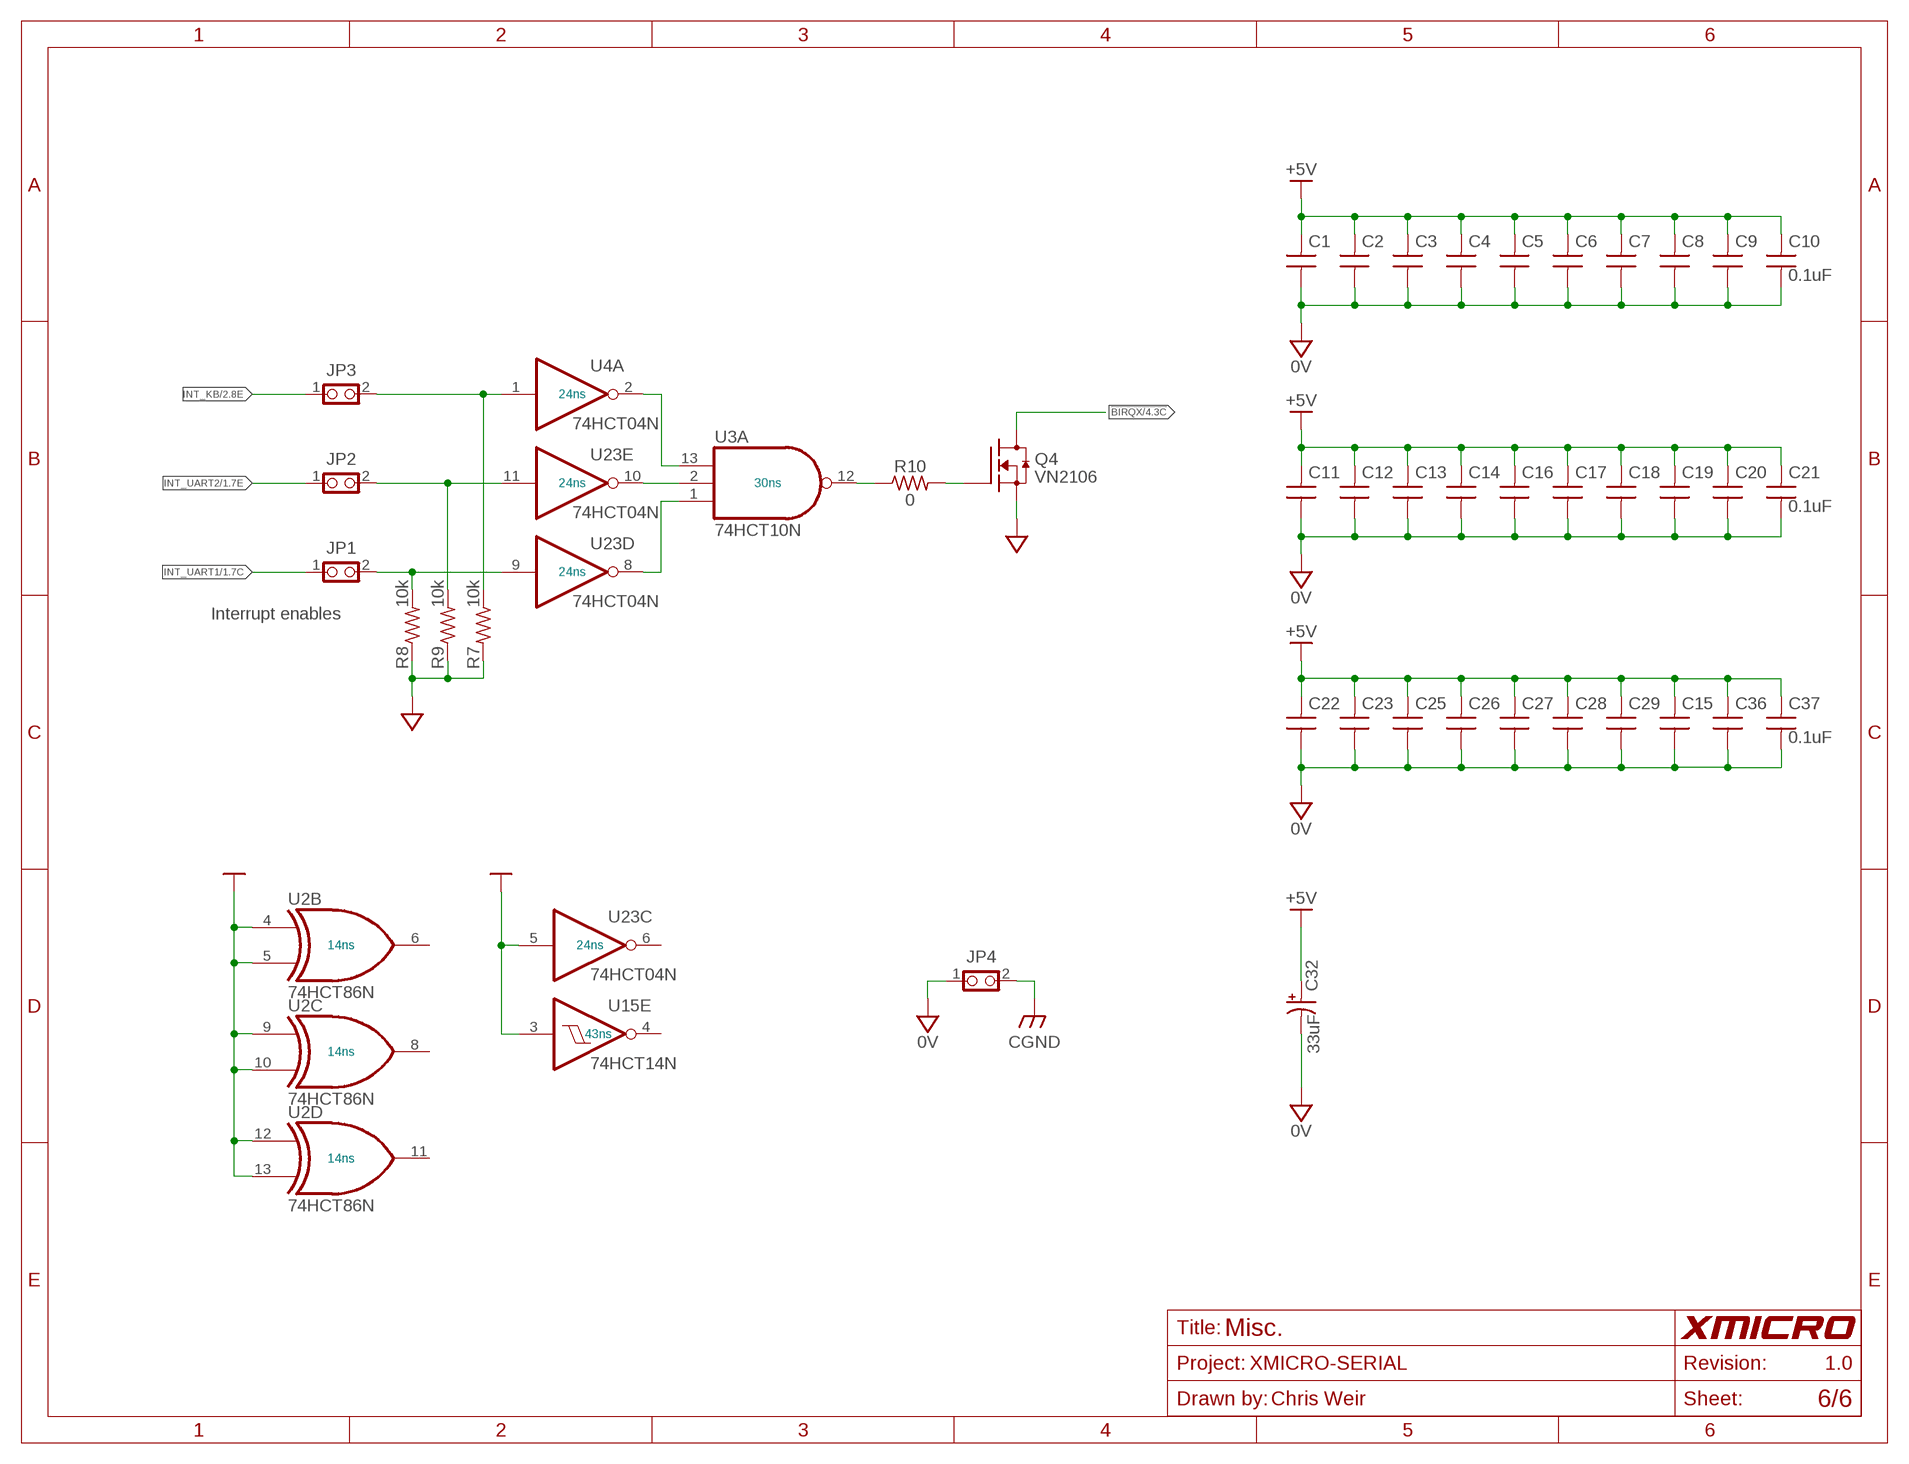
[diagram p5: schematic, sheet 6]
FRAME6 (LETTER): DRAWN_BY: Chris Weir; SHEET_TITLE: Misc.

### Parts
C1  0.1uF  C-US025-024X044  [C025-024X044]
C2  0.1uF  C-US025-024X044  [C025-024X044]
C3  0.1uF  C-US025-024X044  [C025-024X044]
C4  0.1uF  C-US025-024X044  [C025-024X044]
C5  0.1uF  C-US025-024X044  [C025-024X044]
C6  0.1uF  C-US025-024X044  [C025-024X044]
C7  0.1uF  C-US025-024X044  [C025-024X044]
C8  0.1uF  C-US025-024X044  [C025-024X044]
C9  0.1uF  C-US025-024X044  [C025-024X044]
C10  0.1uF  C-US025-024X044  [C025-024X044]
C11  0.1uF  C-US025-024X044  [C025-024X044]
C12  0.1uF  C-US025-024X044  [C025-024X044]
C13  0.1uF  C-US025-024X044  [C025-024X044]
C14  0.1uF  C-US025-024X044  [C025-024X044]
C15  0.1uF  C-US025-024X044  [C025-024X044]
C16  0.1uF  C-US025-024X044  [C025-024X044]
C17  0.1uF  C-US025-024X044  [C025-024X044]
C18  0.1uF  C-US025-024X044  [C025-024X044]
C19  0.1uF  C-US025-024X044  [C025-024X044]
C20  0.1uF  C-US025-024X044  [C025-024X044]
C21  0.1uF  C-US025-024X044  [C025-024X044]
C22  0.1uF  C-US025-024X044  [C025-024X044]
C23  0.1uF  C-US025-024X044  [C025-024X044]
C25  0.1uF  C-US025-024X044  [C025-024X044]
C26  0.1uF  C-US025-024X044  [C025-024X044]
C27  0.1uF  C-US025-024X044  [C025-024X044]
C28  0.1uF  C-US025-024X044  [C025-024X044]
C29  0.1uF  C-US025-024X044  [C025-024X044]
C32  33uF  CPOL-USE2.5-6  [E2,5-6]
C36  0.1uF  C-US025-024X044  [C025-024X044]
C37  0.1uF  C-US025-024X044  [C025-024X044]
JP1  1X2-THRU  [1X2]
JP2  1X2-THRU  [1X2]
JP3  1X2-THRU  [1X2]
JP4  1X2-THRU  [1X2]
Q4  VN2106  [TO92]
R7  10k  R-US_0207/10  [0207/10]
R8  10k  R-US_0207/10  [0207/10]
R9  10k  R-US_0207/10  [0207/10]
R10  0  R-US_0207/10  [0207/10]

### Nets
0V [0V]: C1.2 C2.2 C3.2 C4.2 C5.2 C6.2 C7.2 C8.2 C9.2 C10.2 C11.2 C12.2 C13.2 C14.2 C15.2 C16.2 C17.2 C18.2 C19.2 C20.2 C21.2 C22.2 C23.2 C25.2 C26.2 C27.2 C28.2 C29.2 C32.- C36.2 C37.2 JP4.1 Q4.1(S) R7.2 R8.1 R9.1 ; also sheet 1,2,3,4,5
!BIRQX: Q4.3(D) ; also sheet 4
+5V [SUPPLY]: C1.1 C2.1 C3.1 C4.1 C5.1 C6.1 C7.1 C8.1 C9.1 C10.1 C11.1 C12.1 C13.1 C14.1 C15.1 C16.1 C17.1 C18.1 C19.1 C20.1 C21.1 C22.1 C23.1 C25.1 C26.1 C27.1 C28.1 C29.1 C32.+ C36.1 C37.1 U2.4(B:I0) U2.5(B:I1) U2.9(C:I0) U2.10(C:I1) U2.12(D:I0) U2.13(D:I1) U15.3(E:I) U23.5(C:I) ; also sheet 1,2,3,4,5
CGND [CHASSIS]: JP4.2 ; also sheet 1,2
INT_KB: JP3.1 ; also sheet 2
INT_UART1: JP1.1 ; also sheet 1,5
INT_UART2: JP2.1 ; also sheet 1,5
N$21: R10.1 U3.12(A:O)
N$24: JP3.2 R7.1 U4.1(A:I)
N$25: U3.1(A:I0) U23.8(D:O)
N$44: Q4.2(G) R10.2
N$45: U3.13(A:I2) U4.2(A:O)
N$107: U3.2(A:I1) U23.10(E:O)
N$115: JP1.2 R8.2 U23.9(D:I)
N$118: JP2.2 R9.2 U23.11(E:I)
Unconnected: U2.6(B:O) U2.8(C:O) U2.11(D:O) U15.4(E:O) U23.6(C:O)

### Notes on the sheet
- Interrupt enables

## Power pins joined to a net without a drawn wire
0V: U2.7(P:0V) U3.7(P:0V) U4.7(P:0V) U5.7(P:0V) U6.7(P:0V) U7.7(P:0V) U8.8(0V) U9.8(0V) U10.7(0V) U11.10(0V) U12.7(0V) U13.7(0V) U14.7(P:0V) U15.7(P:0V) U16.10(P:0V) U17.10(P:0V) U18.10(P:0V) U19.7(0V) U20.8(0V) U21.8(0V) U22.10(P:0V) U23.7(P:0V) U25.10(0V) U26.22(0V) U27.22(0V)
+5V: U2.14(P:+5V) U3.14(P:+5V) U4.14(P:+5V) U5.14(P:+5V) U6.14(P:+5V) U7.14(P:+5V) U8.16(+5V) U9.16(+5V) U10.14(+5V) U11.20(+5V) U12.14(+5V) U13.14(+5V) U14.14(P:+5V) U15.14(P:+5V) U16.20(P:+5V) U17.20(P:+5V) U18.20(P:+5V) U19.14(+5V) U20.16(+5V) U21.16(+5V) U22.20(P:+5V) U23.14(P:+5V) U25.20(+5V) U26.44(+5V) U27.44(+5V)

## Library data of the parts
C1-C31 C36 C37 = rcl:C-US: CAPACITOR, American symbol
C32-C35 = rcl:CPOL-US: POLARIZED CAPACITOR, American symbol
J1 J2 = connector-misc:DSUB-9M-P
J3 = connector-misc:MINI-DIN6
J4 = header:1X3
JP1-JP4 = header:1X2-THRU
P1 = xmicro:XMICRO-BUS: XMICRO Bus Symbol with logical pin arrangement
Q1-Q3 = transistor-misc:2N5088
Q4 = transistor-misc:VN2106
R1-R9 = rcl:R-US_: RESISTOR, American symbol
R10 = resistor:R-US_: RESISTOR, American symbol
RN1 RN2 = resistor-sil:E4R: SIL RESISTOR; OC_FARNELL: unknown; OC_NEWARK: unknown
RN3 = resistor-sil:G08R: SIL RESISTOR; OC_FARNELL: unknown; OC_NEWARK: unknown
TP1 TP2 = header:TP: Test Point
U1 = st-microelectronics:NE555: General purpose bipolar Timer; MF: Arrow Electronics; MPN: NE555N; OC_FARNELL: 1467742; OC_NEWARK: 89K1486
U2 = 74xx-us:74*86: Quad 2-input EXCLUSIV-OR (XOR) gate; TPD: 14ns
U3 = 74xx-us:74*10: Triple 3-input NAND gate; TPD: 30ns
U4 U23 = 74xx-us:74*04: Hex INVERTER; TPD: 24ns
U5 U6 U14 = 74xx-us:74*74: Dual D type positive edge triggered FLIP FLOP, preset and clear; TPD: 50ns
U7 = 74xx-us:74*08: Quad 2-input AND gate; TPD: 30ns
U8 U9 = 74xx-us:74*138: 3-line to 8-line DECODER/DEMULTIPLEXER; TPD: 9ns
U10 U19 = 74xx-us:74*280: 9-bit odd/even PARITY GENERATOR/CHECKER; TPD: 53ns
U11 = 74xx-us:74*273: Octal D type FLIP FLOP, clear; TPD: 38ns
U12 U13 = 74xx-us:74*164: 8-bit parallel out SHIFT REGISTER; TPD: 48ns
U15 = 74xx-us:74*14: Hex schmitt trigger INVERTER; TPD: 43ns
U16 U17 = 74xx-us:74*244-1S; TPD: 38ns
U18 = 74xx-us:74*240-1S; TPD: 38ns
U20 U21 = 74xx-us:74*165: 8-bit parallel load SHIFT REGISTER; TPD: 43ns
U22 = 74xx-us:74*244-1S; TPD: 6.6ns
U24 = ic-misc:TC962
U25 = 74xx-us:74*245: Octal BUS TRANSCEIVER, 3-state; TPD: 7.2ns
U26 U27 = ic-misc:16C550
U28 U29 = ic-misc:75C185
Y1 = crystal-misc:OSC-OE

## Net classes
0 default: width 0.254 mm
1 0V: width 0.254 mm, clearance 0.254 mm to class 0
2 CHASSIS: width 0.254 mm, clearance 0.762 mm to class 0, clearance 0.762 mm to class 1
3 SUPPLY: width 0.254 mm, clearance 0.381 mm to class 0, clearance 0.381 mm to class 1, clearance 0.762 mm to class 2, clearance 0.381 mm
4 LOGO: width 0.127 mm